# Altium schematic sheet PowerSupply.SchDoc
size A4
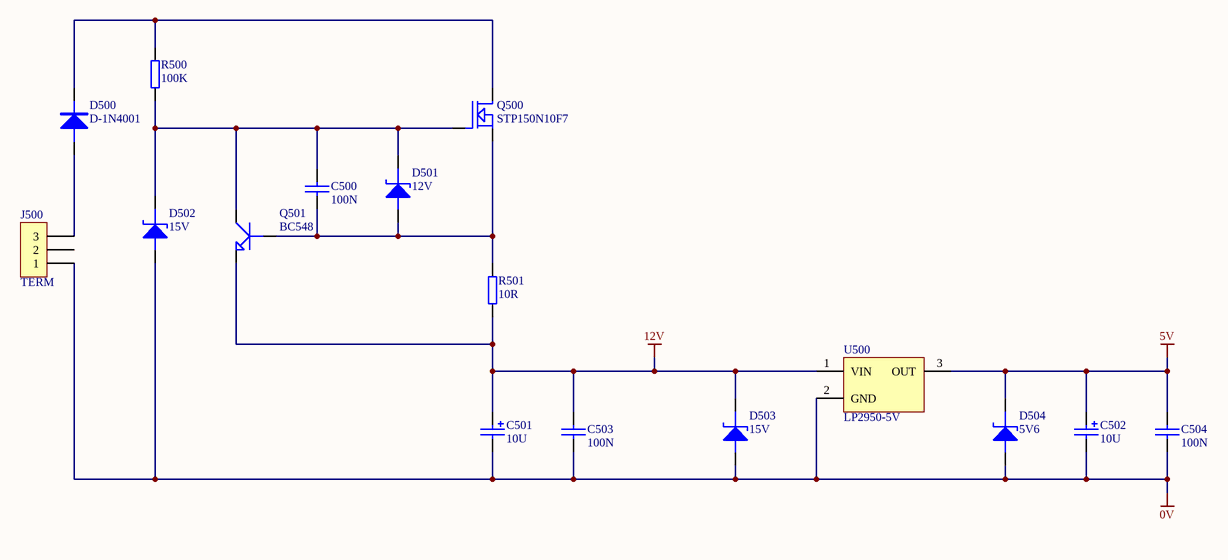
[diagram p0: PowerSupply.SchDoc]

## Parts
C500  100N  [AXIAL02]
C501  10U  [RADIAL02P]
C502  10U  [RADIAL02P]
C503  100N  [AXIAL02]
C504  100N  [AXIAL02]
D500  D-1N4001  [DO35S]
D501  12V  [DO35S]
D502  15V  [DO35S]
D503  15V  [DO35S]
D504  5V6  [DO35S]
J500  TERM  [MKD500S3]
Q500  STP150N10F7  [TO220FS]
Q501  BC548  [TO92]
R500  100K  [AXIAL04]
R501  10R  [AXIAL04]
U500  LP2950-5V  [TO92]

## Nets
0V: C501.2 C502.2 C503.2 C504.2 D502.1(A) D503.1(A) D504.1(A) J500.1 U500.2(GND)
5V: C502.1 C504.1 D504.2(K) U500.3(OUT)
12V: C501.1 C503.1 D503.2(K) Q501.1(E) R501.1 U500.1(VIN)
NetC500_1: C500.1 D501.2(K) D502.2(K) Q500.1(G) Q501.3(C) R500.1
NetC500_2: C500.2 D501.1(A) Q500.3(S) Q501.2(B) R501.2
NetD500_1: D500.1(A) J500.3
NetD500_2: D500.2(K) Q500.2(D) R500.2

Not connected (* = marked no-connect by the designer): J500 2

## Library data of the parts
C500 C503 C504 = C-B100N: CAPACITOR
C501 C502 = C-A10U: CAP
D500 = D-1N4001: 1N4001
D501 = D-BZX79-12: ZENER DIODE
D502 D503 = D-BZX79-15: ZENER DIODE
D504 = D-BZX79-5V6: ZENER DIODE
J500 = J-SCR-3: CONNECTOR
Q500 = Q-STP150N10F7: MOSFET
Q501 = Q-BC548
R500 = R-A100K: RESISTOR; Detail: *; Order: *; Cost: *
R501 = R-A10R: RESISTOR; Detail: *; Order: *; Cost: *
U500 = U-LP2950: LP2950